# Altium schematic sheet HDMI_To_MIPI_PHY.SchDoc
size A4
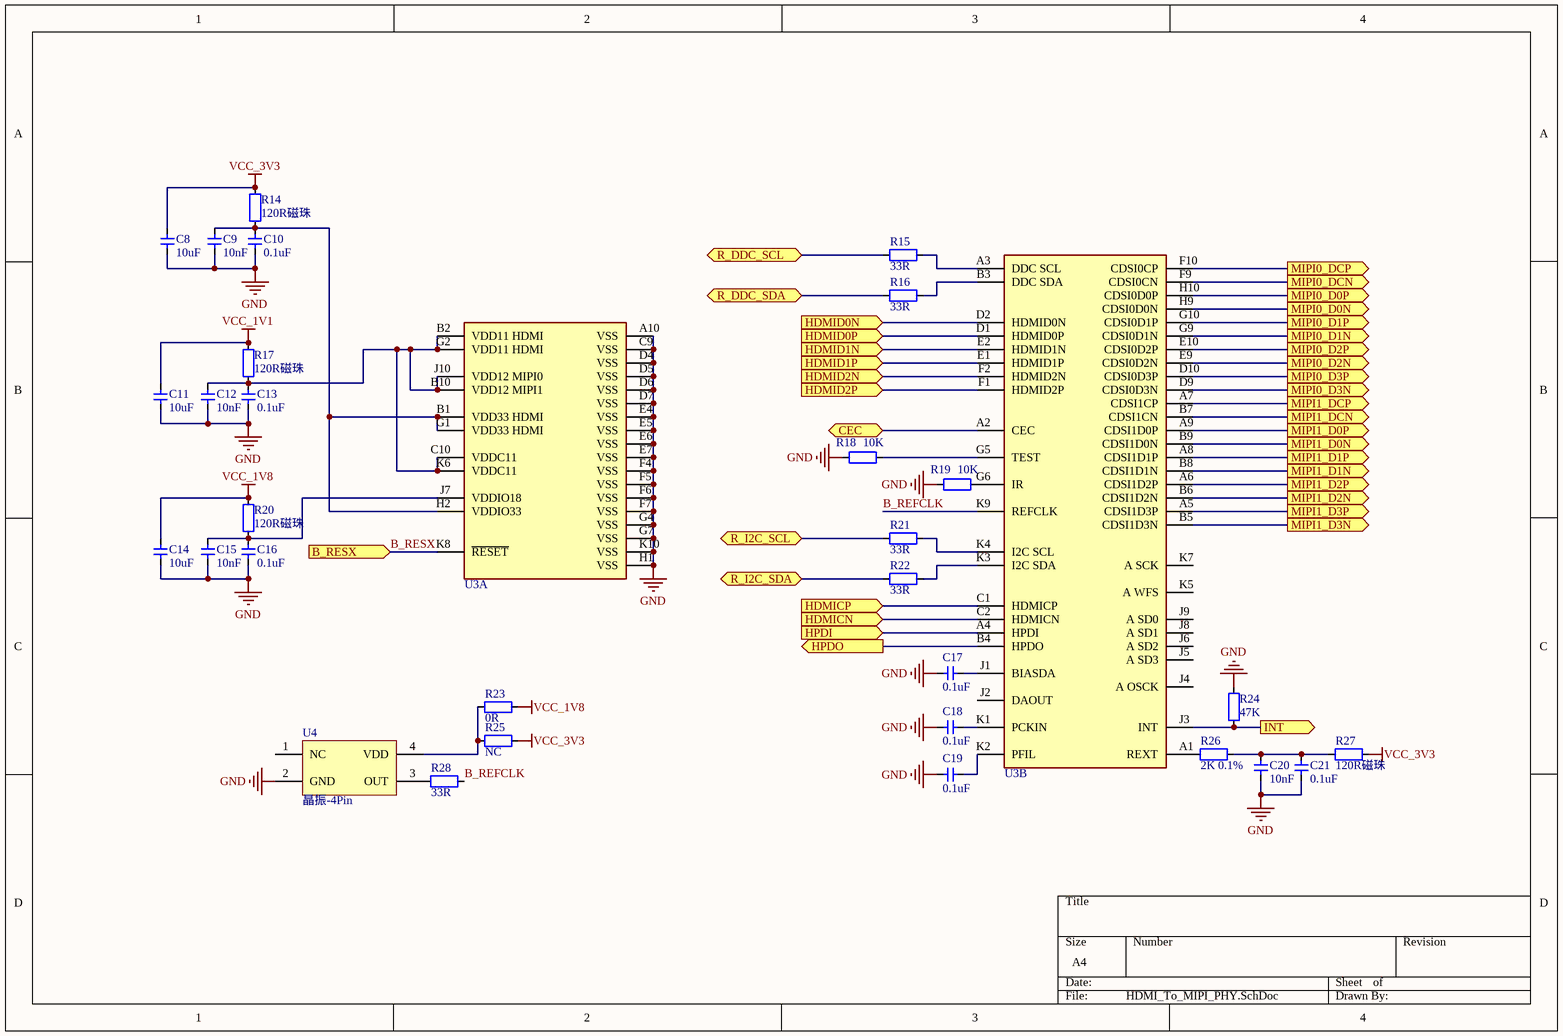
[diagram p0: HDMI_To_MIPI_PHY.SchDoc]

## Parts
C8  10uF  [CAP_0402]
C9  10nF  [CAP_0402]
C10  0.1uF  [CAP_0402]
C11  10uF  [CAP_0402]
C12  10nF  [CAP_0402]
C13  0.1uF  [CAP_0402]
C14  10uF  [CAP_0402]
C15  10nF  [CAP_0402]
C16  0.1uF  [CAP_0402]
C17  0.1uF  [CAP_0402]
C18  0.1uF  [CAP_0402]
C19  0.1uF  [CAP_0402]
C20  10nF  [CAP_0402]
C21  0.1uF  [CAP_0402]
R14  120R磁珠  [0805-L]
R15  33R  [RES_0402]
R16  33R  [RES_0402]
R17  120R磁珠  [0805-L]
R18  10K  [RES_0402]
R19  10K  [RES_0402]
R20  120R磁珠  [0805-L]
R21  33R  [RES_0402]
R22  33R  [RES_0402]
R23  0R  [RES_0402]
R24  47K  [RES_0402]
R25  NC  [RES_0402]
R26  2K 0.1%  [RES_0402]
R27  120R磁珠  [0805-L]
R28  33R  [RES_0402]
U3  TC358870XBG  [VFBGA-80]  (value not drawn)  (parts A,B of 2)
U4  晶振-4Pin  [晶振2520]

## Ports
B_RESX (in), CEC (bidir), HDMICN (in), HDMICP (in), HDMID0N (in), HDMID0P (in), HDMID1N (in), HDMID1P (in), HDMID2N (in), HDMID2P (in), HPDI (in), HPDO (out), INT (out), MIPI0_D0N (out), MIPI0_D0P (out), MIPI0_D1N (out), MIPI0_D1P (out), MIPI0_D2N (out), MIPI0_D2P (out), MIPI0_D3N (out), MIPI0_D3P (out), MIPI0_DCN (out), MIPI0_DCP (out), MIPI1_D0N (out), MIPI1_D0P (out), MIPI1_D1N (out), MIPI1_D1P (out), MIPI1_D2N (out), MIPI1_D2P (out), MIPI1_D3N (out), MIPI1_D3P (out), MIPI1_DCN (out), MIPI1_DCP (out), R_DDC_SCL (bidir), R_DDC_SDA (bidir), R_I2C_SCL (bidir), R_I2C_SDA (bidir)

## Nets
GND: C8.1 C9.1 C10.1 C11.1 C12.1 C13.1 C14.1 C15.1 C16.1 C17.2 C18.2 C19.2 C20.1 C21.1 R18.1 R19.1 R24.2 U3.A10(VSS) U3.C9(VSS) U3.D4(VSS) U3.D5(VSS) U3.D6(VSS) U3.D7(VSS) U3.E4(VSS) U3.E5(VSS) U3.E6(VSS) U3.E7(VSS) U3.F4(VSS) U3.F5(VSS) U3.F6(VSS) U3.F7(VSS) U3.G4(VSS) U3.G7(VSS) U3.H1(VSS) U3.K10(VSS) U4.2(GND)
VCC_1V1: C11.2 R17.2
VCC_1V8: C14.2 R20.2 R23.2
VCC_3V3: C8.2 R14.2 R25.2 R27.2
B_REFCLK: R28.2 U3.K9(REFCLK)
B_RESX: U3.K8(~{RESET}) ; port B_RESX
CEC: U3.A2(CEC) ; port CEC
HDMICN: U3.C2(HDMICN) ; port HDMICN
HDMICP: U3.C1(HDMICP) ; port HDMICP
HDMID0N: U3.D2(HDMID0N) ; port HDMID0N
HDMID0P: U3.D1(HDMID0P) ; port HDMID0P
HDMID1N: U3.E2(HDMID1N) ; port HDMID1N
HDMID1P: U3.E1(HDMID1P) ; port HDMID1P
HDMID2N: U3.F2(HDMID2N) ; port HDMID2N
HDMID2P: U3.F1(HDMID2P) ; port HDMID2P
HPDI: U3.A4(HPDI) ; port HPDI
HPDO: U3.B4(HPDO) ; port HPDO
INT: R24.1 U3.J3(INT) ; port INT
MIPI0_D0N: U3.H9(CDSI0D0N) ; port MIPI0_D0N
MIPI0_D0P: U3.H10(CDSI0D0P) ; port MIPI0_D0P
MIPI0_D1N: U3.G9(CDSI0D1N) ; port MIPI0_D1N
MIPI0_D1P: U3.G10(CDSI0D1P) ; port MIPI0_D1P
MIPI0_D2N: U3.E9(CDSI0D2N) ; port MIPI0_D2N
MIPI0_D2P: U3.E10(CDSI0D2P) ; port MIPI0_D2P
MIPI0_D3N: U3.D9(CDSI0D3N) ; port MIPI0_D3N
MIPI0_D3P: U3.D10(CDSI0D3P) ; port MIPI0_D3P
MIPI0_DCN: U3.F9(CDSI0CN) ; port MIPI0_DCN
MIPI0_DCP: U3.F10(CDSI0CP) ; port MIPI0_DCP
MIPI1_D0N: U3.B9(CDSI1D0N) ; port MIPI1_D0N
MIPI1_D0P: U3.A9(CDSI1D0P) ; port MIPI1_D0P
MIPI1_D1N: U3.B8(CDSI1D1N) ; port MIPI1_D1N
MIPI1_D1P: U3.A8(CDSI1D1P) ; port MIPI1_D1P
MIPI1_D2N: U3.B6(CDSI1D2N) ; port MIPI1_D2N
MIPI1_D2P: U3.A6(CDSI1D2P) ; port MIPI1_D2P
MIPI1_D3N: U3.B5(CDSI1D3N) ; port MIPI1_D3N
MIPI1_D3P: U3.A5(CDSI1D3P) ; port MIPI1_D3P
MIPI1_DCN: U3.B7(CDSI1CN) ; port MIPI1_DCN
MIPI1_DCP: U3.A7(CDSI1CP) ; port MIPI1_DCP
R_DDC_SCL: R15.1 ; port R_DDC_SCL
R_DDC_SDA: R16.1 ; port R_DDC_SDA
R_I2C_SCL: R21.1 ; port R_I2C_SCL
R_I2C_SDA: R22.1 ; port R_I2C_SDA
NetC9_2: C9.2 C10.2 R14.1 U3.B1(VDD33_HDMI) U3.G1(VDD33_HDMI) U3.H2(VDDIO33)
NetC12_2: C12.2 C13.2 R17.1 U3.B2(VDD11_HDMI) U3.B10(VDD12_MIPI1) U3.C10(VDDC11) U3.G2(VDD11_HDMI) U3.J10(VDD12_MIPI0) U3.K6(VDDC11)
NetC15_2: C15.2 C16.2 R20.1 U3.J7(VDDIO18)
NetC17_1: C17.1 U3.J1(BIASDA)
NetC18_1: C18.1 U3.K1(PCKIN)
NetC19_1: C19.1 U3.K2(PFIL)
NetC20_2: C20.2 C21.2 R26.2 R27.1
NetR15_2: R15.2 U3.A3(DDC_SCL)
NetR16_2: R16.2 U3.B3(DDC_SDA)
NetR18_2: R18.2 U3.G5(TEST)
NetR19_2: R19.2 U3.G6(IR)
NetR21_2: R21.2 U3.K4(I2C_SCL)
NetR22_2: R22.2 U3.K3(I2C_SDA)
NetR23_1: R23.1 R25.1 U4.4(VDD)
NetR26_1: R26.1 U3.A1(REXT)
NetR28_1: R28.1 U4.3(OUT)

Not connected (* = marked no-connect by the designer): U3 J2(DAOUT) J4(A_OSCK) J5(A_SD3) J6(A_SD2) J8(A_SD1) J9(A_SD0) K5(A_WFS) K7(A_SCK); U4 1(NC)

## Library data of the parts
C8-C21 = 电容-0402: Capacitor; Value: 0.1u
R14 R17 R20 R27 = 电阻-0805: Resistor; Value: 22R
R15 R16 R18 R19 R21-R26 R28 = 电阻-0402: Resistor; Value: 22R
U4 = 晶振-4Pin: 5032 有源